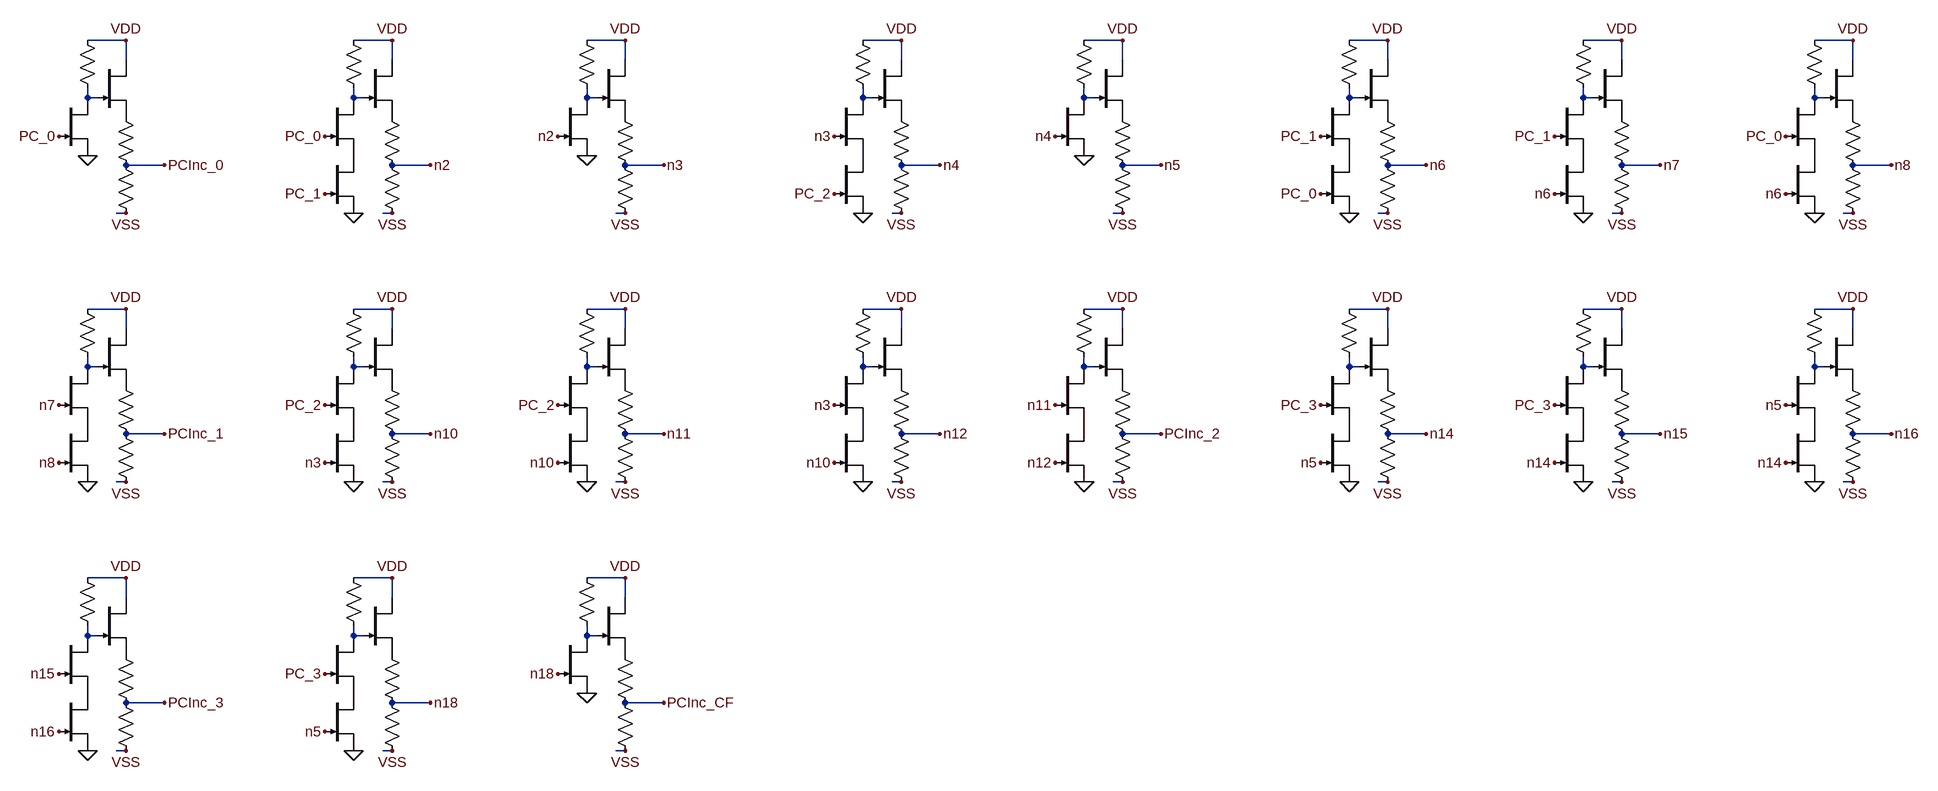
[diagram p0: schematic incrementer_4bit.asc]
incrementer_4bit.asc, the LTspice schematic file:
Version 4.1
SHEET 1 109444 42780
WIRE -5792 -512 -5856 -512
WIRE -5792 -480 -5792 -512
WIRE -5856 -416 -5856 -432
WIRE -5840 -416 -5856 -416
WIRE -5728 -304 -5792 -304
WIRE -5792 -224 -5808 -224
FLAG -5792 -224 VSS
FLAG -5904 -352 PC_0
FLAG -5728 -304 PCInc_0
FLAG -5856 -320 0
FLAG -5792 -512 VDD
SYMBOL res -5872 -528 R0
WINDOW 0 -35 57 Invisible 2
WINDOW 3 34 56 Invisible 2
SYMATTR InstName R1
SYMATTR Value 100k
SYMBOL njf -5840 -480 R0
WINDOW 0 56 32 Invisible 2
WINDOW 3 56 72 Invisible 2
SYMATTR InstName J_F1
SYMATTR Value DR
SYMBOL res -5808 -400 R0
WINDOW 0 -24 60 Invisible 2
WINDOW 3 34 58 Invisible 2
SYMATTR InstName R2
SYMATTR Value 1k
SYMBOL res -5808 -320 R0
WINDOW 0 -22 62 Invisible 2
WINDOW 3 37 62 Invisible 2
SYMATTR InstName R3
SYMATTR Value 4.8k
SYMBOL njf -5904 -416 R0
WINDOW 0 56 32 Invisible 2
WINDOW 3 56 72 Invisible 2
SYMATTR InstName J_B1
SYMATTR Value DR
WIRE -5280 -512 -5344 -512
WIRE -5280 -480 -5280 -512
WIRE -5344 -416 -5344 -432
WIRE -5328 -416 -5344 -416
WIRE -5216 -304 -5280 -304
WIRE -5280 -224 -5296 -224
FLAG -5280 -224 VSS
FLAG -5344 -224 0
FLAG -5392 -352 PC_0
FLAG -5392 -256 PC_1
FLAG -5216 -304 n2
FLAG -5280 -512 VDD
SYMBOL res -5360 -528 R0
WINDOW 0 -35 57 Invisible 2
WINDOW 3 34 56 Invisible 2
SYMATTR InstName R4
SYMATTR Value 100k
SYMBOL njf -5328 -480 R0
WINDOW 0 56 32 Invisible 2
WINDOW 3 56 72 Invisible 2
SYMATTR InstName J_F2
SYMATTR Value DR
SYMBOL res -5296 -400 R0
WINDOW 0 -24 60 Invisible 2
WINDOW 3 34 58 Invisible 2
SYMATTR InstName R5
SYMATTR Value 1k
SYMBOL res -5296 -320 R0
WINDOW 0 -22 62 Invisible 2
WINDOW 3 37 62 Invisible 2
SYMATTR InstName R6
SYMATTR Value 4.8k
SYMBOL njf -5392 -416 R0
WINDOW 0 56 32 Invisible 2
WINDOW 3 56 72 Invisible 2
SYMATTR InstName J_B2
SYMATTR Value DR
SYMBOL njf -5392 -320 R0
WINDOW 0 56 32 Invisible 2
WINDOW 3 56 72 Invisible 2
SYMATTR InstName J_A1
SYMATTR Value DR
WIRE -4768 -512 -4832 -512
WIRE -4768 -480 -4768 -512
WIRE -4832 -416 -4832 -432
WIRE -4816 -416 -4832 -416
WIRE -4704 -304 -4768 -304
WIRE -4768 -224 -4784 -224
FLAG -4768 -224 VSS
FLAG -4880 -352 n2
FLAG -4704 -304 n3
FLAG -4832 -320 0
FLAG -4768 -512 VDD
SYMBOL res -4848 -528 R0
WINDOW 0 -35 57 Invisible 2
WINDOW 3 34 56 Invisible 2
SYMATTR InstName R7
SYMATTR Value 100k
SYMBOL njf -4816 -480 R0
WINDOW 0 56 32 Invisible 2
WINDOW 3 56 72 Invisible 2
SYMATTR InstName J_F3
SYMATTR Value DR
SYMBOL res -4784 -400 R0
WINDOW 0 -24 60 Invisible 2
WINDOW 3 34 58 Invisible 2
SYMATTR InstName R8
SYMATTR Value 1k
SYMBOL res -4784 -320 R0
WINDOW 0 -22 62 Invisible 2
WINDOW 3 37 62 Invisible 2
SYMATTR InstName R9
SYMATTR Value 4.8k
SYMBOL njf -4880 -416 R0
WINDOW 0 56 32 Invisible 2
WINDOW 3 56 72 Invisible 2
SYMATTR InstName J_B3
SYMATTR Value DR
WIRE -4256 -512 -4320 -512
WIRE -4256 -480 -4256 -512
WIRE -4320 -416 -4320 -432
WIRE -4304 -416 -4320 -416
WIRE -4192 -304 -4256 -304
WIRE -4256 -224 -4272 -224
FLAG -4256 -224 VSS
FLAG -4320 -224 0
FLAG -4368 -352 n3
FLAG -4368 -256 PC_2
FLAG -4192 -304 n4
FLAG -4256 -512 VDD
SYMBOL res -4336 -528 R0
WINDOW 0 -35 57 Invisible 2
WINDOW 3 34 56 Invisible 2
SYMATTR InstName R10
SYMATTR Value 100k
SYMBOL njf -4304 -480 R0
WINDOW 0 56 32 Invisible 2
WINDOW 3 56 72 Invisible 2
SYMATTR InstName J_F4
SYMATTR Value DR
SYMBOL res -4272 -400 R0
WINDOW 0 -24 60 Invisible 2
WINDOW 3 34 58 Invisible 2
SYMATTR InstName R11
SYMATTR Value 1k
SYMBOL res -4272 -320 R0
WINDOW 0 -22 62 Invisible 2
WINDOW 3 37 62 Invisible 2
SYMATTR InstName R12
SYMATTR Value 4.8k
SYMBOL njf -4368 -416 R0
WINDOW 0 56 32 Invisible 2
WINDOW 3 56 72 Invisible 2
SYMATTR InstName J_B4
SYMATTR Value DR
SYMBOL njf -4368 -320 R0
WINDOW 0 56 32 Invisible 2
WINDOW 3 56 72 Invisible 2
SYMATTR InstName J_A2
SYMATTR Value DR
WIRE -3744 -512 -3808 -512
WIRE -3744 -480 -3744 -512
WIRE -3808 -416 -3808 -432
WIRE -3792 -416 -3808 -416
WIRE -3680 -304 -3744 -304
WIRE -3744 -224 -3760 -224
FLAG -3744 -224 VSS
FLAG -3856 -352 n4
FLAG -3680 -304 n5
FLAG -3808 -320 0
FLAG -3744 -512 VDD
SYMBOL res -3824 -528 R0
WINDOW 0 -35 57 Invisible 2
WINDOW 3 34 56 Invisible 2
SYMATTR InstName R13
SYMATTR Value 100k
SYMBOL njf -3792 -480 R0
WINDOW 0 56 32 Invisible 2
WINDOW 3 56 72 Invisible 2
SYMATTR InstName J_F5
SYMATTR Value DR
SYMBOL res -3760 -400 R0
WINDOW 0 -24 60 Invisible 2
WINDOW 3 34 58 Invisible 2
SYMATTR InstName R14
SYMATTR Value 1k
SYMBOL res -3760 -320 R0
WINDOW 0 -22 62 Invisible 2
WINDOW 3 37 62 Invisible 2
SYMATTR InstName R15
SYMATTR Value 4.8k
SYMBOL njf -3856 -416 R0
WINDOW 0 56 32 Invisible 2
WINDOW 3 56 72 Invisible 2
SYMATTR InstName J_B5
SYMATTR Value DR
WIRE -3232 -512 -3296 -512
WIRE -3232 -480 -3232 -512
WIRE -3296 -416 -3296 -432
WIRE -3280 -416 -3296 -416
WIRE -3168 -304 -3232 -304
WIRE -3232 -224 -3248 -224
FLAG -3232 -224 VSS
FLAG -3296 -224 0
FLAG -3344 -352 PC_1
FLAG -3344 -256 PC_0
FLAG -3168 -304 n6
FLAG -3232 -512 VDD
SYMBOL res -3312 -528 R0
WINDOW 0 -35 57 Invisible 2
WINDOW 3 34 56 Invisible 2
SYMATTR InstName R16
SYMATTR Value 100k
SYMBOL njf -3280 -480 R0
WINDOW 0 56 32 Invisible 2
WINDOW 3 56 72 Invisible 2
SYMATTR InstName J_F6
SYMATTR Value DR
SYMBOL res -3248 -400 R0
WINDOW 0 -24 60 Invisible 2
WINDOW 3 34 58 Invisible 2
SYMATTR InstName R17
SYMATTR Value 1k
SYMBOL res -3248 -320 R0
WINDOW 0 -22 62 Invisible 2
WINDOW 3 37 62 Invisible 2
SYMATTR InstName R18
SYMATTR Value 4.8k
SYMBOL njf -3344 -416 R0
WINDOW 0 56 32 Invisible 2
WINDOW 3 56 72 Invisible 2
SYMATTR InstName J_B6
SYMATTR Value DR
SYMBOL njf -3344 -320 R0
WINDOW 0 56 32 Invisible 2
WINDOW 3 56 72 Invisible 2
SYMATTR InstName J_A3
SYMATTR Value DR
WIRE -2720 -512 -2784 -512
WIRE -2720 -480 -2720 -512
WIRE -2784 -416 -2784 -432
WIRE -2768 -416 -2784 -416
WIRE -2656 -304 -2720 -304
WIRE -2720 -224 -2736 -224
FLAG -2720 -224 VSS
FLAG -2784 -224 0
FLAG -2832 -352 PC_1
FLAG -2832 -256 n6
FLAG -2656 -304 n7
FLAG -2720 -512 VDD
SYMBOL res -2800 -528 R0
WINDOW 0 -35 57 Invisible 2
WINDOW 3 34 56 Invisible 2
SYMATTR InstName R19
SYMATTR Value 100k
SYMBOL njf -2768 -480 R0
WINDOW 0 56 32 Invisible 2
WINDOW 3 56 72 Invisible 2
SYMATTR InstName J_F7
SYMATTR Value DR
SYMBOL res -2736 -400 R0
WINDOW 0 -24 60 Invisible 2
WINDOW 3 34 58 Invisible 2
SYMATTR InstName R20
SYMATTR Value 1k
SYMBOL res -2736 -320 R0
WINDOW 0 -22 62 Invisible 2
WINDOW 3 37 62 Invisible 2
SYMATTR InstName R21
SYMATTR Value 4.8k
SYMBOL njf -2832 -416 R0
WINDOW 0 56 32 Invisible 2
WINDOW 3 56 72 Invisible 2
SYMATTR InstName J_B7
SYMATTR Value DR
SYMBOL njf -2832 -320 R0
WINDOW 0 56 32 Invisible 2
WINDOW 3 56 72 Invisible 2
SYMATTR InstName J_A4
SYMATTR Value DR
WIRE -2208 -512 -2272 -512
WIRE -2208 -480 -2208 -512
WIRE -2272 -416 -2272 -432
WIRE -2256 -416 -2272 -416
WIRE -2144 -304 -2208 -304
WIRE -2208 -224 -2224 -224
FLAG -2208 -224 VSS
FLAG -2272 -224 0
FLAG -2320 -352 PC_0
FLAG -2320 -256 n6
FLAG -2144 -304 n8
FLAG -2208 -512 VDD
SYMBOL res -2288 -528 R0
WINDOW 0 -35 57 Invisible 2
WINDOW 3 34 56 Invisible 2
SYMATTR InstName R22
SYMATTR Value 100k
SYMBOL njf -2256 -480 R0
WINDOW 0 56 32 Invisible 2
WINDOW 3 56 72 Invisible 2
SYMATTR InstName J_F8
SYMATTR Value DR
SYMBOL res -2224 -400 R0
WINDOW 0 -24 60 Invisible 2
WINDOW 3 34 58 Invisible 2
SYMATTR InstName R23
SYMATTR Value 1k
SYMBOL res -2224 -320 R0
WINDOW 0 -22 62 Invisible 2
WINDOW 3 37 62 Invisible 2
SYMATTR InstName R24
SYMATTR Value 4.8k
SYMBOL njf -2320 -416 R0
WINDOW 0 56 32 Invisible 2
WINDOW 3 56 72 Invisible 2
SYMATTR InstName J_B8
SYMATTR Value DR
SYMBOL njf -2320 -320 R0
WINDOW 0 56 32 Invisible 2
WINDOW 3 56 72 Invisible 2
SYMATTR InstName J_A5
SYMATTR Value DR
WIRE -5792 96 -5856 96
WIRE -5792 128 -5792 96
WIRE -5856 192 -5856 176
WIRE -5840 192 -5856 192
WIRE -5728 304 -5792 304
WIRE -5792 384 -5808 384
FLAG -5792 384 VSS
FLAG -5856 384 0
FLAG -5904 256 n7
FLAG -5904 352 n8
FLAG -5728 304 PCInc_1
FLAG -5792 96 VDD
SYMBOL res -5872 80 R0
WINDOW 0 -35 57 Invisible 2
WINDOW 3 34 56 Invisible 2
SYMATTR InstName R25
SYMATTR Value 100k
SYMBOL njf -5840 128 R0
WINDOW 0 56 32 Invisible 2
WINDOW 3 56 72 Invisible 2
SYMATTR InstName J_F9
SYMATTR Value DR
SYMBOL res -5808 208 R0
WINDOW 0 -24 60 Invisible 2
WINDOW 3 34 58 Invisible 2
SYMATTR InstName R26
SYMATTR Value 1k
SYMBOL res -5808 288 R0
WINDOW 0 -22 62 Invisible 2
WINDOW 3 37 62 Invisible 2
SYMATTR InstName R27
SYMATTR Value 4.8k
SYMBOL njf -5904 192 R0
WINDOW 0 56 32 Invisible 2
WINDOW 3 56 72 Invisible 2
SYMATTR InstName J_B9
SYMATTR Value DR
SYMBOL njf -5904 288 R0
WINDOW 0 56 32 Invisible 2
WINDOW 3 56 72 Invisible 2
SYMATTR InstName J_A6
SYMATTR Value DR
WIRE -5280 96 -5344 96
WIRE -5280 128 -5280 96
WIRE -5344 192 -5344 176
WIRE -5328 192 -5344 192
WIRE -5216 304 -5280 304
WIRE -5280 384 -5296 384
FLAG -5280 384 VSS
FLAG -5344 384 0
FLAG -5392 256 PC_2
FLAG -5392 352 n3
FLAG -5216 304 n10
FLAG -5280 96 VDD
SYMBOL res -5360 80 R0
WINDOW 0 -35 57 Invisible 2
WINDOW 3 34 56 Invisible 2
SYMATTR InstName R28
SYMATTR Value 100k
SYMBOL njf -5328 128 R0
WINDOW 0 56 32 Invisible 2
WINDOW 3 56 72 Invisible 2
SYMATTR InstName J_F10
SYMATTR Value DR
SYMBOL res -5296 208 R0
WINDOW 0 -24 60 Invisible 2
WINDOW 3 34 58 Invisible 2
SYMATTR InstName R29
SYMATTR Value 1k
SYMBOL res -5296 288 R0
WINDOW 0 -22 62 Invisible 2
WINDOW 3 37 62 Invisible 2
SYMATTR InstName R30
SYMATTR Value 4.8k
SYMBOL njf -5392 192 R0
WINDOW 0 56 32 Invisible 2
WINDOW 3 56 72 Invisible 2
SYMATTR InstName J_B10
SYMATTR Value DR
SYMBOL njf -5392 288 R0
WINDOW 0 56 32 Invisible 2
WINDOW 3 56 72 Invisible 2
SYMATTR InstName J_A7
SYMATTR Value DR
WIRE -4768 96 -4832 96
WIRE -4768 128 -4768 96
WIRE -4832 192 -4832 176
WIRE -4816 192 -4832 192
WIRE -4704 304 -4768 304
WIRE -4768 384 -4784 384
FLAG -4768 384 VSS
FLAG -4832 384 0
FLAG -4880 256 PC_2
FLAG -4880 352 n10
FLAG -4704 304 n11
FLAG -4768 96 VDD
SYMBOL res -4848 80 R0
WINDOW 0 -35 57 Invisible 2
WINDOW 3 34 56 Invisible 2
SYMATTR InstName R31
SYMATTR Value 100k
SYMBOL njf -4816 128 R0
WINDOW 0 56 32 Invisible 2
WINDOW 3 56 72 Invisible 2
SYMATTR InstName J_F11
SYMATTR Value DR
SYMBOL res -4784 208 R0
WINDOW 0 -24 60 Invisible 2
WINDOW 3 34 58 Invisible 2
SYMATTR InstName R32
SYMATTR Value 1k
SYMBOL res -4784 288 R0
WINDOW 0 -22 62 Invisible 2
WINDOW 3 37 62 Invisible 2
SYMATTR InstName R33
SYMATTR Value 4.8k
SYMBOL njf -4880 192 R0
WINDOW 0 56 32 Invisible 2
WINDOW 3 56 72 Invisible 2
SYMATTR InstName J_B11
SYMATTR Value DR
SYMBOL njf -4880 288 R0
WINDOW 0 56 32 Invisible 2
WINDOW 3 56 72 Invisible 2
SYMATTR InstName J_A8
SYMATTR Value DR
WIRE -4256 96 -4320 96
WIRE -4256 128 -4256 96
WIRE -4320 192 -4320 176
WIRE -4304 192 -4320 192
WIRE -4192 304 -4256 304
WIRE -4256 384 -4272 384
FLAG -4256 384 VSS
FLAG -4320 384 0
FLAG -4368 256 n3
FLAG -4368 352 n10
FLAG -4192 304 n12
FLAG -4256 96 VDD
SYMBOL res -4336 80 R0
WINDOW 0 -35 57 Invisible 2
WINDOW 3 34 56 Invisible 2
SYMATTR InstName R34
SYMATTR Value 100k
SYMBOL njf -4304 128 R0
WINDOW 0 56 32 Invisible 2
WINDOW 3 56 72 Invisible 2
SYMATTR InstName J_F12
SYMATTR Value DR
SYMBOL res -4272 208 R0
WINDOW 0 -24 60 Invisible 2
WINDOW 3 34 58 Invisible 2
SYMATTR InstName R35
SYMATTR Value 1k
SYMBOL res -4272 288 R0
WINDOW 0 -22 62 Invisible 2
WINDOW 3 37 62 Invisible 2
SYMATTR InstName R36
SYMATTR Value 4.8k
SYMBOL njf -4368 192 R0
WINDOW 0 56 32 Invisible 2
WINDOW 3 56 72 Invisible 2
SYMATTR InstName J_B12
SYMATTR Value DR
SYMBOL njf -4368 288 R0
WINDOW 0 56 32 Invisible 2
WINDOW 3 56 72 Invisible 2
SYMATTR InstName J_A9
SYMATTR Value DR
WIRE -3744 96 -3808 96
WIRE -3744 128 -3744 96
WIRE -3808 192 -3808 176
WIRE -3792 192 -3808 192
WIRE -3680 304 -3744 304
WIRE -3744 384 -3760 384
FLAG -3744 384 VSS
FLAG -3808 384 0
FLAG -3856 256 n11
FLAG -3856 352 n12
FLAG -3680 304 PCInc_2
FLAG -3744 96 VDD
SYMBOL res -3824 80 R0
WINDOW 0 -35 57 Invisible 2
WINDOW 3 34 56 Invisible 2
SYMATTR InstName R37
SYMATTR Value 100k
SYMBOL njf -3792 128 R0
WINDOW 0 56 32 Invisible 2
WINDOW 3 56 72 Invisible 2
SYMATTR InstName J_F13
SYMATTR Value DR
SYMBOL res -3760 208 R0
WINDOW 0 -24 60 Invisible 2
WINDOW 3 34 58 Invisible 2
SYMATTR InstName R38
SYMATTR Value 1k
SYMBOL res -3760 288 R0
WINDOW 0 -22 62 Invisible 2
WINDOW 3 37 62 Invisible 2
SYMATTR InstName R39
SYMATTR Value 4.8k
SYMBOL njf -3856 192 R0
WINDOW 0 56 32 Invisible 2
WINDOW 3 56 72 Invisible 2
SYMATTR InstName J_B13
SYMATTR Value DR
SYMBOL njf -3856 288 R0
WINDOW 0 56 32 Invisible 2
WINDOW 3 56 72 Invisible 2
SYMATTR InstName J_A10
SYMATTR Value DR
WIRE -3232 96 -3296 96
WIRE -3232 128 -3232 96
WIRE -3296 192 -3296 176
WIRE -3280 192 -3296 192
WIRE -3168 304 -3232 304
WIRE -3232 384 -3248 384
FLAG -3232 384 VSS
FLAG -3296 384 0
FLAG -3344 256 PC_3
FLAG -3344 352 n5
FLAG -3168 304 n14
FLAG -3232 96 VDD
SYMBOL res -3312 80 R0
WINDOW 0 -35 57 Invisible 2
WINDOW 3 34 56 Invisible 2
SYMATTR InstName R40
SYMATTR Value 100k
SYMBOL njf -3280 128 R0
WINDOW 0 56 32 Invisible 2
WINDOW 3 56 72 Invisible 2
SYMATTR InstName J_F14
SYMATTR Value DR
SYMBOL res -3248 208 R0
WINDOW 0 -24 60 Invisible 2
WINDOW 3 34 58 Invisible 2
SYMATTR InstName R41
SYMATTR Value 1k
SYMBOL res -3248 288 R0
WINDOW 0 -22 62 Invisible 2
WINDOW 3 37 62 Invisible 2
SYMATTR InstName R42
SYMATTR Value 4.8k
SYMBOL njf -3344 192 R0
WINDOW 0 56 32 Invisible 2
WINDOW 3 56 72 Invisible 2
SYMATTR InstName J_B14
SYMATTR Value DR
SYMBOL njf -3344 288 R0
WINDOW 0 56 32 Invisible 2
WINDOW 3 56 72 Invisible 2
SYMATTR InstName J_A11
SYMATTR Value DR
WIRE -2720 96 -2784 96
WIRE -2720 128 -2720 96
WIRE -2784 192 -2784 176
WIRE -2768 192 -2784 192
WIRE -2656 304 -2720 304
WIRE -2720 384 -2736 384
FLAG -2720 384 VSS
FLAG -2784 384 0
FLAG -2832 256 PC_3
FLAG -2832 352 n14
FLAG -2656 304 n15
FLAG -2720 96 VDD
SYMBOL res -2800 80 R0
WINDOW 0 -35 57 Invisible 2
WINDOW 3 34 56 Invisible 2
SYMATTR InstName R43
SYMATTR Value 100k
SYMBOL njf -2768 128 R0
WINDOW 0 56 32 Invisible 2
WINDOW 3 56 72 Invisible 2
SYMATTR InstName J_F15
SYMATTR Value DR
SYMBOL res -2736 208 R0
WINDOW 0 -24 60 Invisible 2
WINDOW 3 34 58 Invisible 2
SYMATTR InstName R44
SYMATTR Value 1k
SYMBOL res -2736 288 R0
WINDOW 0 -22 62 Invisible 2
WINDOW 3 37 62 Invisible 2
SYMATTR InstName R45
SYMATTR Value 4.8k
SYMBOL njf -2832 192 R0
WINDOW 0 56 32 Invisible 2
WINDOW 3 56 72 Invisible 2
SYMATTR InstName J_B15
SYMATTR Value DR
SYMBOL njf -2832 288 R0
WINDOW 0 56 32 Invisible 2
WINDOW 3 56 72 Invisible 2
SYMATTR InstName J_A12
SYMATTR Value DR
WIRE -2208 96 -2272 96
WIRE -2208 128 -2208 96
WIRE -2272 192 -2272 176
WIRE -2256 192 -2272 192
WIRE -2144 304 -2208 304
WIRE -2208 384 -2224 384
FLAG -2208 384 VSS
FLAG -2272 384 0
FLAG -2320 256 n5
FLAG -2320 352 n14
FLAG -2144 304 n16
FLAG -2208 96 VDD
SYMBOL res -2288 80 R0
WINDOW 0 -35 57 Invisible 2
WINDOW 3 34 56 Invisible 2
SYMATTR InstName R46
SYMATTR Value 100k
SYMBOL njf -2256 128 R0
WINDOW 0 56 32 Invisible 2
WINDOW 3 56 72 Invisible 2
SYMATTR InstName J_F16
SYMATTR Value DR
SYMBOL res -2224 208 R0
WINDOW 0 -24 60 Invisible 2
WINDOW 3 34 58 Invisible 2
SYMATTR InstName R47
SYMATTR Value 1k
SYMBOL res -2224 288 R0
WINDOW 0 -22 62 Invisible 2
WINDOW 3 37 62 Invisible 2
SYMATTR InstName R48
SYMATTR Value 4.8k
SYMBOL njf -2320 192 R0
WINDOW 0 56 32 Invisible 2
WINDOW 3 56 72 Invisible 2
SYMATTR InstName J_B16
SYMATTR Value DR
SYMBOL njf -2320 288 R0
WINDOW 0 56 32 Invisible 2
WINDOW 3 56 72 Invisible 2
SYMATTR InstName J_A13
SYMATTR Value DR
WIRE -5792 704 -5856 704
WIRE -5792 736 -5792 704
WIRE -5856 800 -5856 784
WIRE -5840 800 -5856 800
WIRE -5728 912 -5792 912
WIRE -5792 992 -5808 992
FLAG -5792 992 VSS
FLAG -5856 992 0
FLAG -5904 864 n15
FLAG -5904 960 n16
FLAG -5728 912 PCInc_3
FLAG -5792 704 VDD
SYMBOL res -5872 688 R0
WINDOW 0 -35 57 Invisible 2
WINDOW 3 34 56 Invisible 2
SYMATTR InstName R49
SYMATTR Value 100k
SYMBOL njf -5840 736 R0
WINDOW 0 56 32 Invisible 2
WINDOW 3 56 72 Invisible 2
SYMATTR InstName J_F17
SYMATTR Value DR
SYMBOL res -5808 816 R0
WINDOW 0 -24 60 Invisible 2
WINDOW 3 34 58 Invisible 2
SYMATTR InstName R50
SYMATTR Value 1k
SYMBOL res -5808 896 R0
WINDOW 0 -22 62 Invisible 2
WINDOW 3 37 62 Invisible 2
SYMATTR InstName R51
SYMATTR Value 4.8k
SYMBOL njf -5904 800 R0
WINDOW 0 56 32 Invisible 2
WINDOW 3 56 72 Invisible 2
SYMATTR InstName J_B17
SYMATTR Value DR
SYMBOL njf -5904 896 R0
WINDOW 0 56 32 Invisible 2
WINDOW 3 56 72 Invisible 2
SYMATTR InstName J_A14
SYMATTR Value DR
WIRE -5280 704 -5344 704
WIRE -5280 736 -5280 704
WIRE -5344 800 -5344 784
WIRE -5328 800 -5344 800
WIRE -5216 912 -5280 912
WIRE -5280 992 -5296 992
FLAG -5280 992 VSS
FLAG -5344 992 0
FLAG -5392 864 PC_3
FLAG -5392 960 n5
FLAG -5216 912 n18
FLAG -5280 704 VDD
SYMBOL res -5360 688 R0
WINDOW 0 -35 57 Invisible 2
WINDOW 3 34 56 Invisible 2
SYMATTR InstName R52
SYMATTR Value 100k
SYMBOL njf -5328 736 R0
WINDOW 0 56 32 Invisible 2
WINDOW 3 56 72 Invisible 2
SYMATTR InstName J_F18
SYMATTR Value DR
SYMBOL res -5296 816 R0
WINDOW 0 -24 60 Invisible 2
WINDOW 3 34 58 Invisible 2
SYMATTR InstName R53
SYMATTR Value 1k
SYMBOL res -5296 896 R0
WINDOW 0 -22 62 Invisible 2
WINDOW 3 37 62 Invisible 2
SYMATTR InstName R54
SYMATTR Value 4.8k
SYMBOL njf -5392 800 R0
WINDOW 0 56 32 Invisible 2
WINDOW 3 56 72 Invisible 2
SYMATTR InstName J_B18
SYMATTR Value DR
SYMBOL njf -5392 896 R0
WINDOW 0 56 32 Invisible 2
WINDOW 3 56 72 Invisible 2
SYMATTR InstName J_A15
SYMATTR Value DR
WIRE -4768 704 -4832 704
WIRE -4768 736 -4768 704
WIRE -4832 800 -4832 784
WIRE -4816 800 -4832 800
WIRE -4704 912 -4768 912
WIRE -4768 992 -4784 992
FLAG -4768 992 VSS
FLAG -4880 864 n18
FLAG -4704 912 PCInc_CF
FLAG -4832 896 0
FLAG -4768 704 VDD
SYMBOL res -4848 688 R0
WINDOW 0 -35 57 Invisible 2
WINDOW 3 34 56 Invisible 2
SYMATTR InstName R55
SYMATTR Value 100k
SYMBOL njf -4816 736 R0
WINDOW 0 56 32 Invisible 2
WINDOW 3 56 72 Invisible 2
SYMATTR InstName J_F19
SYMATTR Value DR
SYMBOL res -4784 816 R0
WINDOW 0 -24 60 Invisible 2
WINDOW 3 34 58 Invisible 2
SYMATTR InstName R56
SYMATTR Value 1k
SYMBOL res -4784 896 R0
WINDOW 0 -22 62 Invisible 2
WINDOW 3 37 62 Invisible 2
SYMATTR InstName R57
SYMATTR Value 4.8k
SYMBOL njf -4880 800 R0
WINDOW 0 56 32 Invisible 2
WINDOW 3 56 72 Invisible 2
SYMATTR InstName J_B19
SYMATTR Value DR

The netlist it stands for:
* incrementer_4bit.asc
R1 VDD N001 100k
J_F1 VDD N001 P001 DR
R2 P001 PCInc_0 1k
R3 PCInc_0 VSS 4.8k
J_B1 N001 PC_0 0 DR
R4 VDD N002 100k
J_F2 VDD N002 P002 DR
R5 P002 n2 1k
R6 n2 VSS 4.8k
J_B2 N002 PC_0 P003 DR
J_A1 P003 PC_1 0 DR
R7 VDD N003 100k
J_F3 VDD N003 P004 DR
R8 P004 n3 1k
R9 n3 VSS 4.8k
J_B3 N003 n2 0 DR
R10 VDD N004 100k
J_F4 VDD N004 P005 DR
R11 P005 n4 1k
R12 n4 VSS 4.8k
J_B4 N004 n3 P006 DR
J_A2 P006 PC_2 0 DR
R13 VDD N005 100k
J_F5 VDD N005 P007 DR
R14 P007 n5 1k
R15 n5 VSS 4.8k
J_B5 N005 n4 0 DR
R16 VDD N006 100k
J_F6 VDD N006 P008 DR
R17 P008 n6 1k
R18 n6 VSS 4.8k
J_B6 N006 PC_1 P009 DR
J_A3 P009 PC_0 0 DR
R19 VDD N007 100k
J_F7 VDD N007 P010 DR
R20 P010 n7 1k
R21 n7 VSS 4.8k
J_B7 N007 PC_1 P011 DR
J_A4 P011 n6 0 DR
R22 VDD N008 100k
J_F8 VDD N008 P012 DR
R23 P012 n8 1k
R24 n8 VSS 4.8k
J_B8 N008 PC_0 P013 DR
J_A5 P013 n6 0 DR
R25 VDD N009 100k
J_F9 VDD N009 P014 DR
R26 P014 PCInc_1 1k
R27 PCInc_1 VSS 4.8k
J_B9 N009 n7 P015 DR
J_A6 P015 n8 0 DR
R28 VDD N010 100k
J_F10 VDD N010 P016 DR
R29 P016 n10 1k
R30 n10 VSS 4.8k
J_B10 N010 PC_2 P017 DR
J_A7 P017 n3 0 DR
R31 VDD N011 100k
J_F11 VDD N011 P018 DR
R32 P018 n11 1k
R33 n11 VSS 4.8k
J_B11 N011 PC_2 P019 DR
J_A8 P019 n10 0 DR
R34 VDD N012 100k
J_F12 VDD N012 P020 DR
R35 P020 n12 1k
R36 n12 VSS 4.8k
J_B12 N012 n3 P021 DR
J_A9 P021 n10 0 DR
R37 VDD N013 100k
J_F13 VDD N013 P022 DR
R38 P022 PCInc_2 1k
R39 PCInc_2 VSS 4.8k
J_B13 N013 n11 P023 DR
J_A10 P023 n12 0 DR
R40 VDD N014 100k
J_F14 VDD N014 P024 DR
R41 P024 n14 1k
R42 n14 VSS 4.8k
J_B14 N014 PC_3 P025 DR
J_A11 P025 n5 0 DR
R43 VDD N015 100k
J_F15 VDD N015 P026 DR
R44 P026 n15 1k
R45 n15 VSS 4.8k
J_B15 N015 PC_3 P027 DR
J_A12 P027 n14 0 DR
R46 VDD N016 100k
J_F16 VDD N016 P028 DR
R47 P028 n16 1k
R48 n16 VSS 4.8k
J_B16 N016 n5 P029 DR
J_A13 P029 n14 0 DR
R49 VDD N017 100k
J_F17 VDD N017 P030 DR
R50 P030 PCInc_3 1k
R51 PCInc_3 VSS 4.8k
J_B17 N017 n15 P031 DR
J_A14 P031 n16 0 DR
R52 VDD N018 100k
J_F18 VDD N018 P032 DR
R53 P032 n18 1k
R54 n18 VSS 4.8k
J_B18 N018 PC_3 P033 DR
J_A15 P033 n5 0 DR
R55 VDD N019 100k
J_F19 VDD N019 P034 DR
R56 P034 PCInc_CF 1k
R57 PCInc_CF VSS 4.8k
J_B19 N019 n18 0 DR
.model NJF NJF
.model PJF PJF
.lib standard.jft
.backanno
.end